# EAGLE design PhasedArrayReceiver1 (EAGLE 9.5.2)
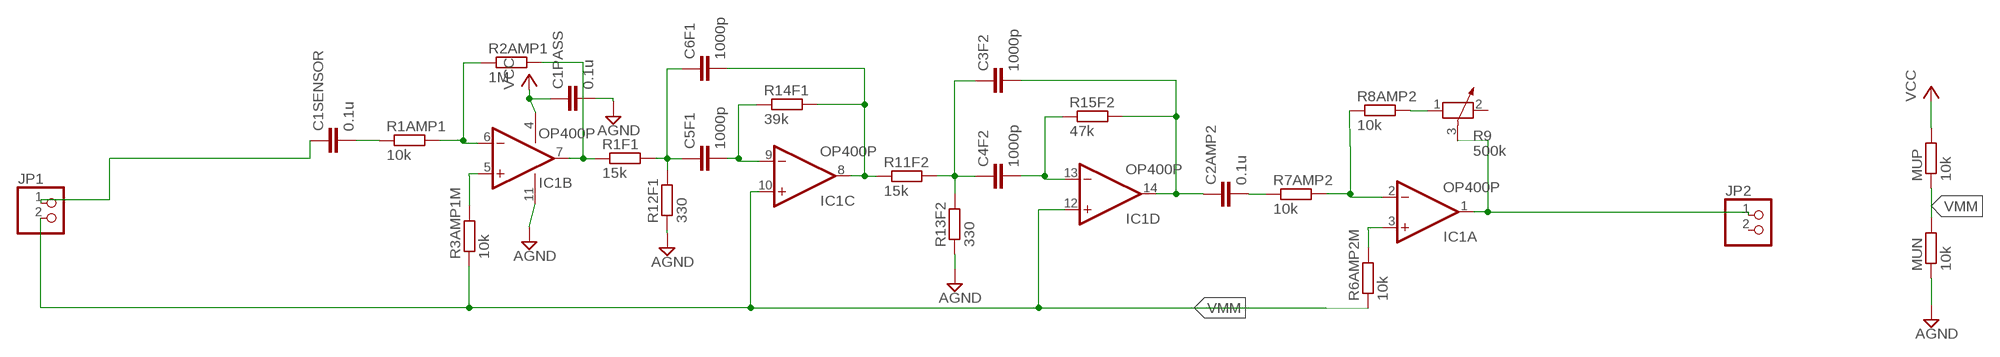
[diagram p0: schematic, sheet 1]

## Parts
C1PASS  0.1u  C-EU025-024X044  [C025-024X044]
C1SENSOR  0.1u  C-EUC0603K  [C0603K]
C2AMP2  0.1u  C-EUC0603K  [C0603K]
C3F2  1000p  C-EUC0603K  [C0603K]
C4F2  1000p  C-EUC0603K  [C0603K]
C5F1  1000p  C-EUC0603K  [C0603K]
C6F1  1000p  C-EUC0603K  [C0603K]
IC1  OP400P  [DIL14]
JP1  PINHD-1X2  [1X02]
JP2  PINHD-1X2  [1X02]
MUN  10k  R-EU_0207/7  [0207/7]
MUP  10k  R-EU_0207/7  [0207/7]
R1AMP1  10k  R-EU_R0603  [R0603]
R1F1  15k  R-EU_0207/7  [0207/7]
R2AMP1  1M  R-EU_R0603  [R0603]
R3AMP1M  10k  R-EU_R0603  [R0603]
R6AMP2M  10k  R-EU_R0603  [R0603]
R7AMP2  10k  R-EU_R0603  [R0603]
R8AMP2  10k  R-EU_R0603  [R0603]
R9  500k  POTENTIOMETER_PT-10  [PT-10]
R11F2  15k  R-EU_R0603  [R0603]
R12F1  330  R-EU_R0603  [R0603]
R13F2  330  R-EU_R0603  [R0603]
R14F1  39k  R-EU_0207/7  [0207/7]
R15F2  47k  R-EU_0207/7  [0207/7]

## Nets
AGND [power]: C1PASS.2 IC1.11(P:V-) MUN.1 R12F1.1 R13F2.1
N$1: IC1.6(B:-IN) R1AMP1.2 R2AMP1.1
N$2: IC1.5(B:+IN) R3AMP1M.2
N$3: IC1.7(B:OUT) R1F1.1 R2AMP1.2
N$4: IC1.2(A:-IN) R7AMP2.2 R8AMP2.1
N$6: C1SENSOR.1 JP1.1
N$7: IC1.3(A:+IN) R6AMP2M.2
N$8: C1SENSOR.2 R1AMP1.1
N$9: C2AMP2.2 R7AMP2.1
N$10: R8AMP2.2 R9.1
N$11: IC1.1(A:OUT) JP2.1 R9.3
N$12: C2AMP2.1 C3F2.2 IC1.14(D:OUT) R15F2.2
N$13: C5F1.2 IC1.9(C:-IN) R14F1.1
N$14: C4F2.2 IC1.13(D:-IN) R15F2.1
N$15: C3F2.1 C4F2.1 R11F2.2 R13F2.2
N$16: C6F1.2 IC1.8(C:OUT) R11F2.1 R14F1.2
N$17: C5F1.1 C6F1.1 R1F1.2 R12F1.2
VCC [power]: C1PASS.1 IC1.4(P:V+) MUP.2
VMM [power]: IC1.10(C:+IN) IC1.12(D:+IN) JP1.2 MUN.2 MUP.1 R3AMP1M.1 R6AMP2M.1
Unconnected: JP2.2 R9.2

## Library data of the parts
C1PASS C1SENSOR C2AMP2 C3F2 C4F2 C5F1 C6F1 = rcl:C-EU: CAPACITOR, European symbol; SPICEPREFIX: C
IC1 = linear:OP400: OP AMP
JP1 JP2 = pinhead:PINHD-1X2: PIN HEADER
MUN MUP R1AMP1 R1F1 R2AMP1 R3AMP1M R6AMP2M R7AMP2 R8AMP2 R11F2 R12F1 R13F2 R14F1 R15F2 = rcl:R-EU_: RESISTOR, European symbol; SPICEPREFIX: R
R9 = rcl:POTENTIOMETER_: Potentiometer; SPICEMODEL: POT; SPICEPREFIX: X

## Net classes
0 default: width 0.61 mm, clearance 0.203 mm
1 power: width 0.914 mm, clearance 0.254 mm

## Board
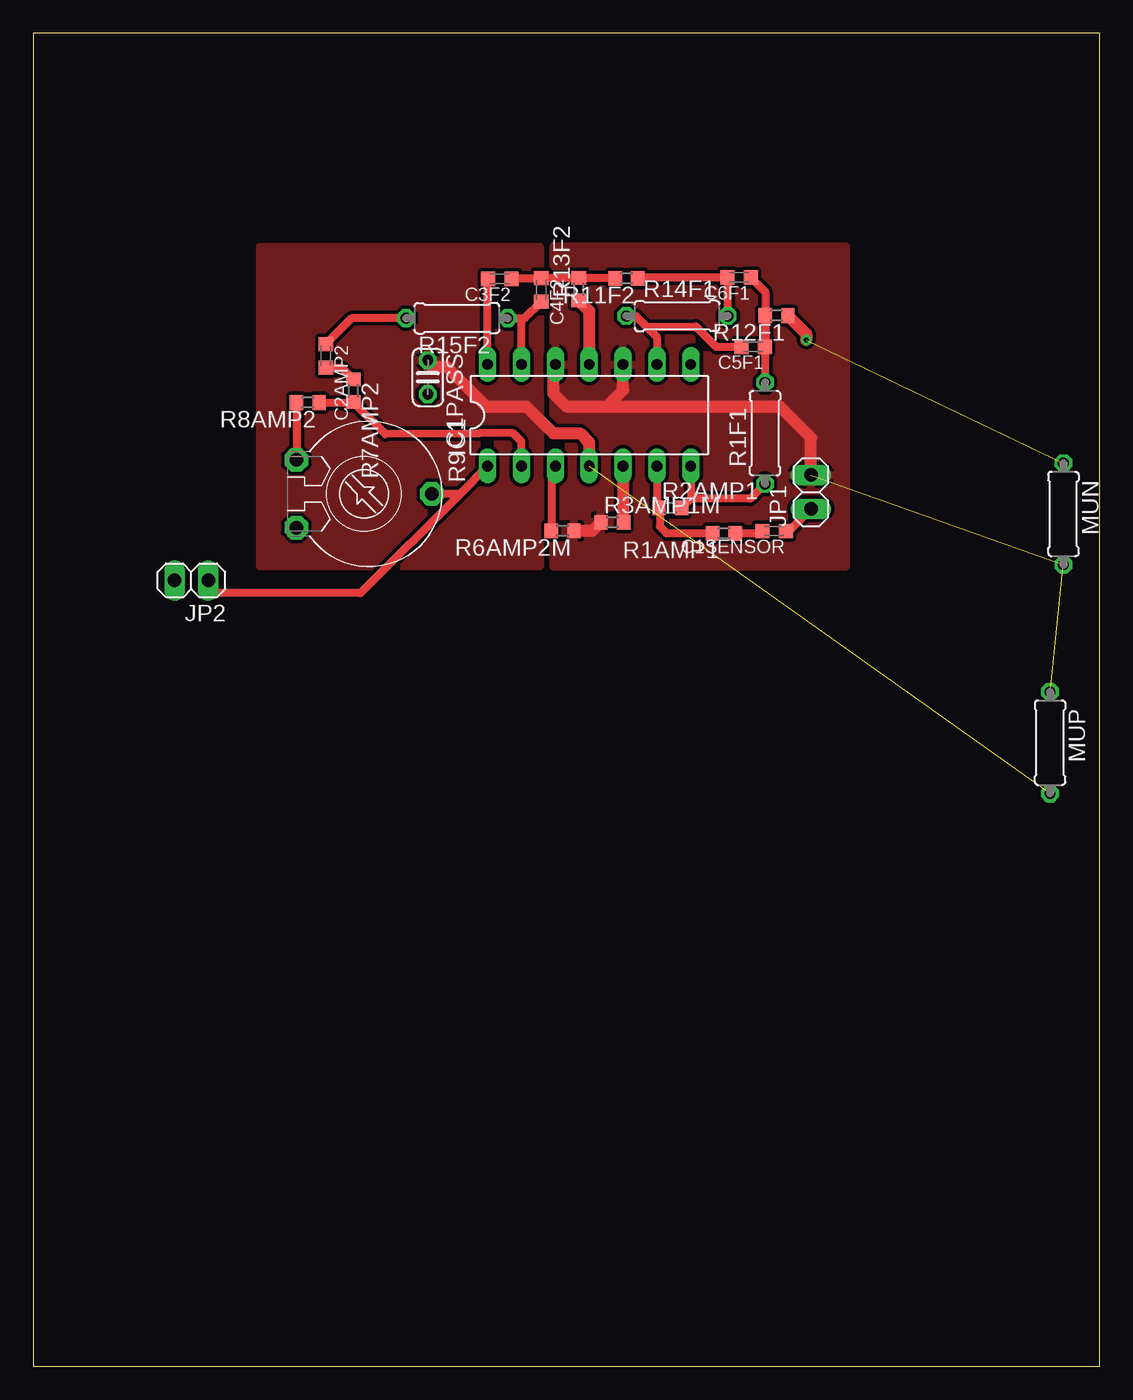
[diagram p1: board, top side]
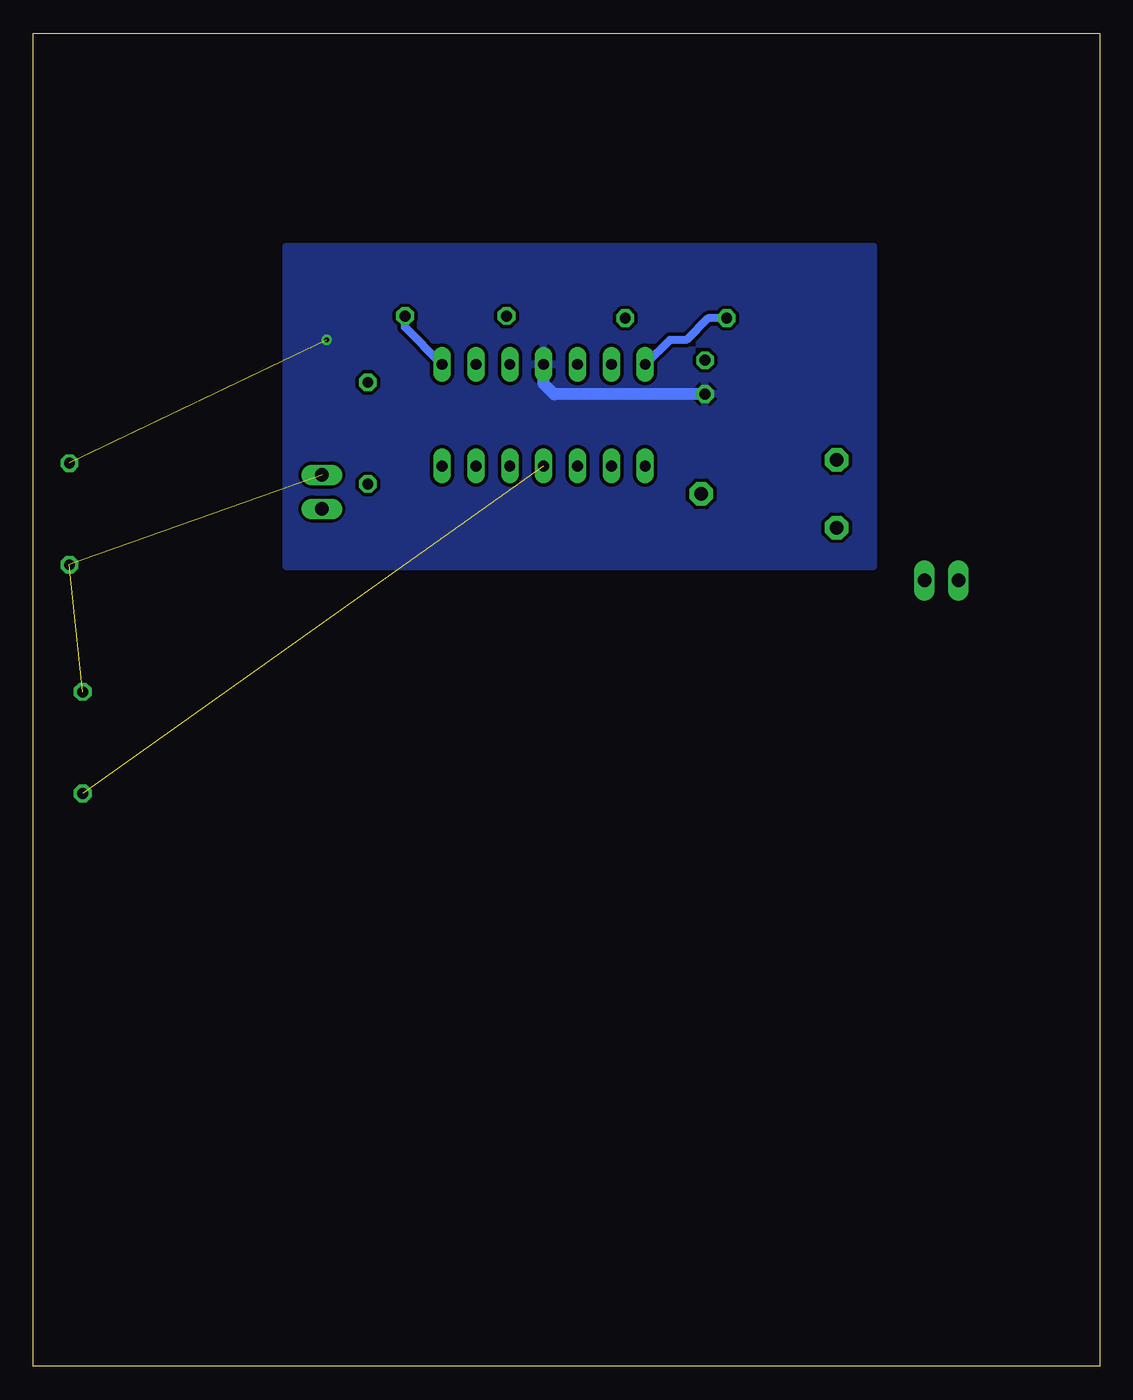
[diagram p2: board, bottom side, seen from below]

Size 80 x 100 mm. Coordinates in mm from the lower left corner, seen from the top.
Outline: 0,0 80,0 80,100 0,100 0,0
Copper layers (1*16): Top 0.035mm / dielectric 1.5mm / Bottom 0.035mm
Design rules "default": minimum track width 6mil, minimum drill 0.35mm, track to track 6mil, track to pad 6mil, pad to pad 6mil, via to via 6mil, smd to smd 6mil, copper to edge 40mil, drill to drill 6mil, minimum pad ring 10mil, minimum via ring 8mil, stop-mask expansion 4mil, vias tented up to drill 0mil, thermal gap 10mil

### Footprints (pad centres in the part's own frame; a part is rotated, then mirrored left to right if it is on the bottom)
C025-024X044 = drill 0.813 octagon: 1 -1.27,0; 2 1.27,0
C0603K = smd 1.05 x 1.08: 1 -0.875,0; 2 0.875,0
DIL14 = drill 0.813 long: 1 -7.62,-3.81; 2 -5.08,-3.81; 3 -2.54,-3.81; 4 0,-3.81; 5 2.54,-3.81; 6 5.08,-3.81; 7 7.62,-3.81; 8 7.62,3.81; 9 5.08,3.81; 10 2.54,3.81; 11 0,3.81; 12 -2.54,3.81; 13 -5.08,3.81; 14 -7.62,3.81
1X02 = drill 1.016 long: 1 -1.27,0; 2 1.27,0
0207/7 = drill 0.813 octagon: 1 -3.81,0; 2 3.81,0
R0603 = smd 1 x 1.1: 1 -0.85,0; 2 0.85,0
PT-10 = drill 1.016 pad 1.778 octagon: 1 -2.54,-5.08; 2 2.54,-5.08; 3 0,5.08

### Placement (x,y rotation side)
C1PASS  29.6,74.2 270 top
C1SENSOR  55.58,62.66 180 top
C2AMP2  21.94,75.8 270 top
C3F2  35.01,81.58 180 top
C4F2  38.12,80.76 270 top
C5F1  54.01,76.48 180 top
C6F1  52.96,81.68 180 top
IC1  41.71,71.35 0 top
JP1  58.35,65.59 90 top
JP2  11.86,58.95 180 top
MUN  77.29,63.94 270 top
MUP  76.29,46.78 270 top
R1AMP1  51.82,62.5 180 top
R1F1  54.9,70 90 top
R2AMP1  47.79,64.4 0 top
R3AMP1M  43.44,63.32 0 top
R6AMP2M  39.72,62.68 180 top
R7AMP2  24,73.2 270 top
R8AMP2  20.59,72.3 180 top
R9  24.81,65.45 270 top
R11F2  44.51,81.62 180 top
R12F1  55.77,78.82 180 top
R13F2  40.92,80.81 90 top
R14F1  48.3,78.79 0 top
R15F2  31.78,78.63 180 top

### Tracks (layer width: path | path; a pad name or v marks a point on that pad's centre or on a via)
AGND  (via drill 0.35)  (1 unrouted)
  Top 0.914: R13F2.1 41.71,79.17 IC1.11 | R12F1.1 58,77.44 v58,77
  Bottom 0.914: C1PASS.2 40.93,72.93 41.71,73.71 IC1.11
  pour Bottom: 17,60 61,60 61,84 19,84 17,84
N$1
  Top 0.61: IC1.6 46.79,64.55 R2AMP1.1 47,64.34 47,63 47.5,62.5 R1AMP1.2
N$2
  Top 0.914: IC1.5 44.25,63.36 R3AMP1M.2
N$3
  Top 0.61: IC1.7 49.33,65.09 | 49.33,65.09 R2AMP1.2 | R1F1.1 53.8,65.09 49.33,65.09
N$4
  Top 0.61: IC1.2 36.63,69.37 36,70 33.44,70 33.42,69.98 26.43,69.92 R7AMP2.2 23.95,72.3 R8AMP2.1
N$6
  Top 0.61: C1SENSOR.1 56.69,62.66 JP1.1
N$7
  Top 0.61: IC1.3 38.87,67.24 R6AMP2M.2
N$8
  Top 0.61: R1AMP1.1 54.55,62.5 C1SENSOR.2
N$9
  Top 0.61: C2AMP2.2 23.12,74.92 R7AMP2.1
N$10
  Top 0.61: R8AMP2.2 R9.1
N$11
  Top 0.61: IC1.1 32,65.45 | 32,65.45 R9.3 | 32,65.45 24.55,58 13,58 13,58.82 JP2.1
N$12
  Top 0.61: R15F2.2 23.89,78.63 C2AMP2.1 | IC1.14 34.09,81.53 C3F2.2
  Bottom 0.61: R15F2.2 29.37,78.63 31,77 32.25,77 IC1.14
N$13
  Top 0.61: R14F1.1 45.21,78.79 46,78 | IC1.9 46.79,77.21 46,78 | 46,78 49.72,78 51.23,76.48 C5F1.2
N$14
  Top 0.61: R15F2.1 36.87,78.63 | 36.87,78.63 C4F2.2 | IC1.13 36.63,78.39 36.87,78.63
N$15
  Top 0.61: C3F2.1 35.94,81.64 C4F2.1 38.15,81.66 R13F2.2 43.62,81.66 R11F2.2
N$16
  Top 0.61: R11F2.1 45.42,81.68 C6F1.2 52.09,78.81 R14F1.2
  Bottom 0.61: IC1.8 52.11,77.94 R14F1.2
N$17
  Top 0.61: C6F1.1 54.92,80.59 R12F1.2 54.92,76.52 C5F1.1 54.9,76.47 R1F1.2
VCC  (1 unrouted)
  Top 0.914: 41.71,68.29 IC1.4 41.71,69.29 41,70 39,70 37,72 34,72 31,75 30.07,75 C1PASS.1
  pour Top: 17,84 38,84 38,60 17,60
VMM  (2 unrouted)
  Top 0.914: IC1.12 39,74.99 39,73 40,72 43,72 | 43,72 44.25,73.25 IC1.10 | 43,72 56,72 58.35,69.65 JP1.2 | R6AMP2M.1 41.95,62.68 R3AMP1M.1
  pour Top: 61,60 61,84 39,84 39,60